# EAGLE schematic INTERFACE_LPC11u35 (EAGLE 7.6.0)
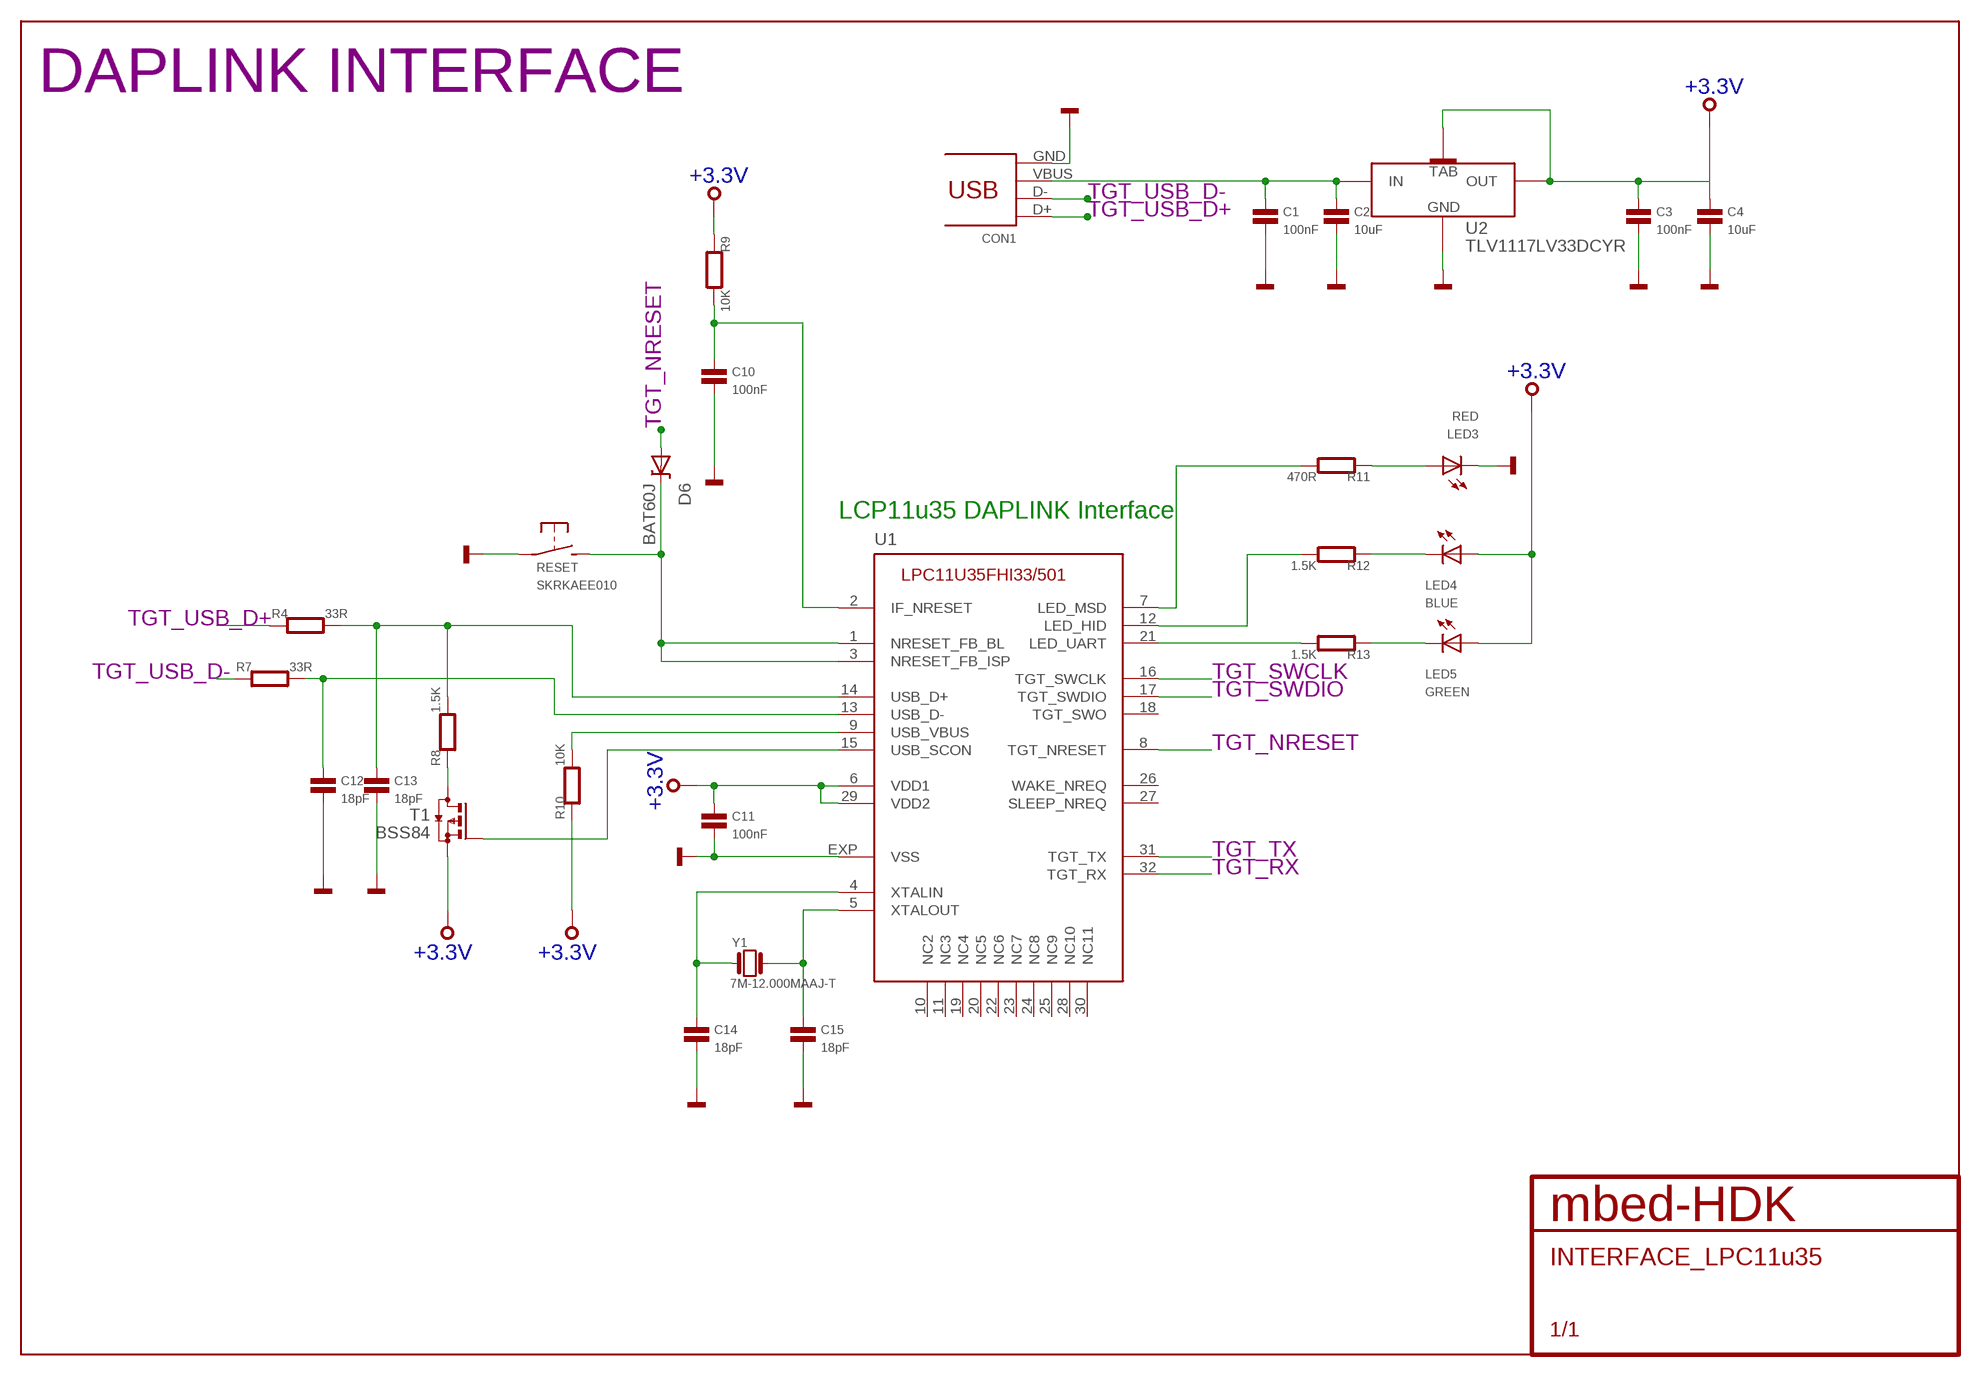
[diagram p0: schematic, sheet 1]

## Parts
C1  100nF  CAPACITOR0402  [0402]
C2  10uF  CAPACITOR0603  [0603]
C3  100nF  CAPACITOR0402  [0402]
C4  10uF  CAPACITOR0603  [0603]
C10  100nF  CAPACITOR0402  [0402]
C11  100nF  CAPACITOR0402  [0402]
C12  18pF  CAPACITOR0402  [0402]
C13  18pF  CAPACITOR0402  [0402]
C14  18pF  CAPACITOR0402  [0402]
C15  18pF  CAPACITOR0402  [0402]
CON1  47346-0001  [USB-MICRO-B-H]
D6  BAT60J  [SOD323]
LED3  RED  SMD_LED0603  [CHIPLED_0603]
LED4  BLUE  SMD_LED0603  [CHIPLED_0603]
LED5  GREEN  SMD_LED0603  [CHIPLED_0603]
R4  33R  RESISTOR0402  [0402]
R7  33R  RESISTOR0402  [0402]
R8  1.5K  RESISTOR0402  [0402]
R9  10K  RESISTOR0402  [0402]
R10  10K  RESISTOR0402  [0402]
R11  470R  RESISTOR0402  [0402]
R12  1.5K  RESISTOR0402  [0402]
R13  1.5K  RESISTOR0402  [0402]
RESET  SKRKAEE010  [SKRKAEE010]
T1  BSS84  [SOT23-3]
U1  IF_LPC11U35FHI33/501  [HVQFN33]
U2  TLV1117LV33DCYR  [SOT223]
Y1  7M-12.000MAAJ-T  [3.2X.2.5]

## Nets
+3.3V: C3.1 C4.1 C11.1 LED4.A LED5.A R9.1 R10.1 T1.2(S) U1.6(VDD1) U1.29(VDD2) U2.OUT(1)(OUT) U2.OUT(2)(TAB)
GND: C1.2 C2.2 C3.2 C4.2 C10.2 C11.2 C12.2 C13.2 C14.2 C15.2 CON1.GND LED3.C RESET.P$1(P) U1.EXP(VSS) U2.GND
HID: R12.2 U1.12(LED_HID)
IF_NRESET: C10.1 R9.2 U1.2(IF_NRESET)
ISP: D6.K RESET.P$2(S) U1.1(NRESET_FB_BL) U1.3(NRESET_FB_ISP)
MSD: R11.2 U1.7(LED_MSD)
N$1: C1.1 C2.1 CON1.VBUS U2.IN
N$2: LED3.A R11.1
N$21: C13.1 R4.2 R8.2 U1.14(USB_D+)
N$24: C12.1 R7.2 U1.13(USB_D-)
N$26: T1.1(G) U1.15(USB_SCON)
N$27: R8.1 T1.3(D)
N$28: R10.2 U1.9(USB_VBUS)
N$35: LED4.C R12.1
N$36: LED5.C R13.1
N$37: C15.1 U1.5(XTALOUT) Y1.P$3
N$40: C14.1 U1.4(XTALIN) Y1.P$1
TGT_NRESET: D6.A U1.8(TGT_NRESET)
TGT_RX: U1.32(TGT_RX)
TGT_SWCLK: U1.16(TGT_SWCLK)
TGT_SWDIO: U1.17(TGT_SWDIO)
TGT_TX: U1.31(TGT_TX)
TGT_USB_D+: CON1.D+ R4.1
TGT_USB_D-: CON1.D- R7.1
UART: R13.2 U1.21(LED_UART)
Unconnected: U1.10(NC2) U1.11(NC3) U1.18(TGT_SWO) U1.19(NC4) U1.20(NC5) U1.22(NC6) U1.23(NC7) U1.24(NC8) U1.25(NC9) U1.26(WAKE_NREQ) U1.27(SLEEP_NREQ) U1.28(NC10) U1.30(NC11)

## Notes on the sheet
- DAPLINK INTERFACE
- LCP11u35 DAPLINK Interface

## Library data of the parts
C1 C3 C10-C15 = mbed-HDK-RLCQ:CAPACITOR: Capacitor
C2 C4 = mbed-HDK-RLC:CAPACITOR: Capacitor
CON1 = mbed-HDK-Connector:47346-0001: USB Receptacle Horizontal Micro Type B; MF: MOLEX; MFN: 47346-0001; OC-MOUSER: 538-47346-0001; OC-NEWARK: 1568026
D6 = mbed-HDK-Transistor:BAT60J: SCHOTTKY DIODE; MF: STMicroelectronics; MFN: BAT60JFILM; OC-DIGIKEY: 497-3707-6-ND; OC-MOUSER: 511-BAT60JFILM; OC-NEWARK: 89K1218
LED3-LED5 = mbed-HDK-Optical:SMD_LED: LED SMD, Colour Red; MF: Wurth Electronics Inc; MFN: 150060RS75000; OC-DIGIKEY: 732-4978-1-ND; OC-MOUSER: 710-150060RS75000; OC-NEWARK: 2322071
R4 R7-R13 = mbed-HDK-RLCQ:RESISTOR: Resistor
RESET = mbed-HDK-Switch:SKRKAEE010: MOMENTARY SWITCH PUSH VERTICAL (SPST); MF: ALPS; MFN: SKRKAEE010; OC-MOUSER: 688-SKRKAE
T1 = mbed-HDK-Transistor:BSS84: MOSFET P-CHANNEL; MF: Fairchild Semiconductor; MFN: BSS84; OC-DIGIKEY: BSS84CT-ND; OC-MOUSER: 512-BSS84; OC-NEWARK: 58K8770
U1 = mbed-HDK-MF-NXP:IF_LPC11U35FHI33/501: CMSIS-DAP Interface : 32-bit LPC11U00 ARM Cortex M3 RISC 64KB Flash 2.5V/3.3V 33-Pin HVQFN EP; MF: NXP; MFN: LPC11U35FHI33/501; OC-DIGIKEY: 568-9586-ND; OC-MOUSER: 771-LPC11U35FHI33501; OC-NEWARK: 2115658
U2 = mbed-HDK-Power:TLV1117LV33DCYR: LDO Fixed Regulator 3.3v, 1A; MF: Texas Instruments; MFN: TLV1117LV33DCYR; OC-DIGIKEY: 296-28778-1-ND; OC-MOUSER: 595-TLV1117LV33DCYR; OC-NEWARK: 2323647
Y1 = mbed-HDK-Oscillator:7M-12.000MAAJ-T: Crystal, TXC 12MHz ±30ppm 18pF; MF: TXC; MFN: 7M-12.000MAAJ-T; OC-DIGIKEY: 887-1121-1-ND; OC-MOUSER: 717-7M-12.000MAAJ-T; OC-NEWARK: 84R5706